# EAGLE design Headlightsv3 (EAGLE 7.6.0)
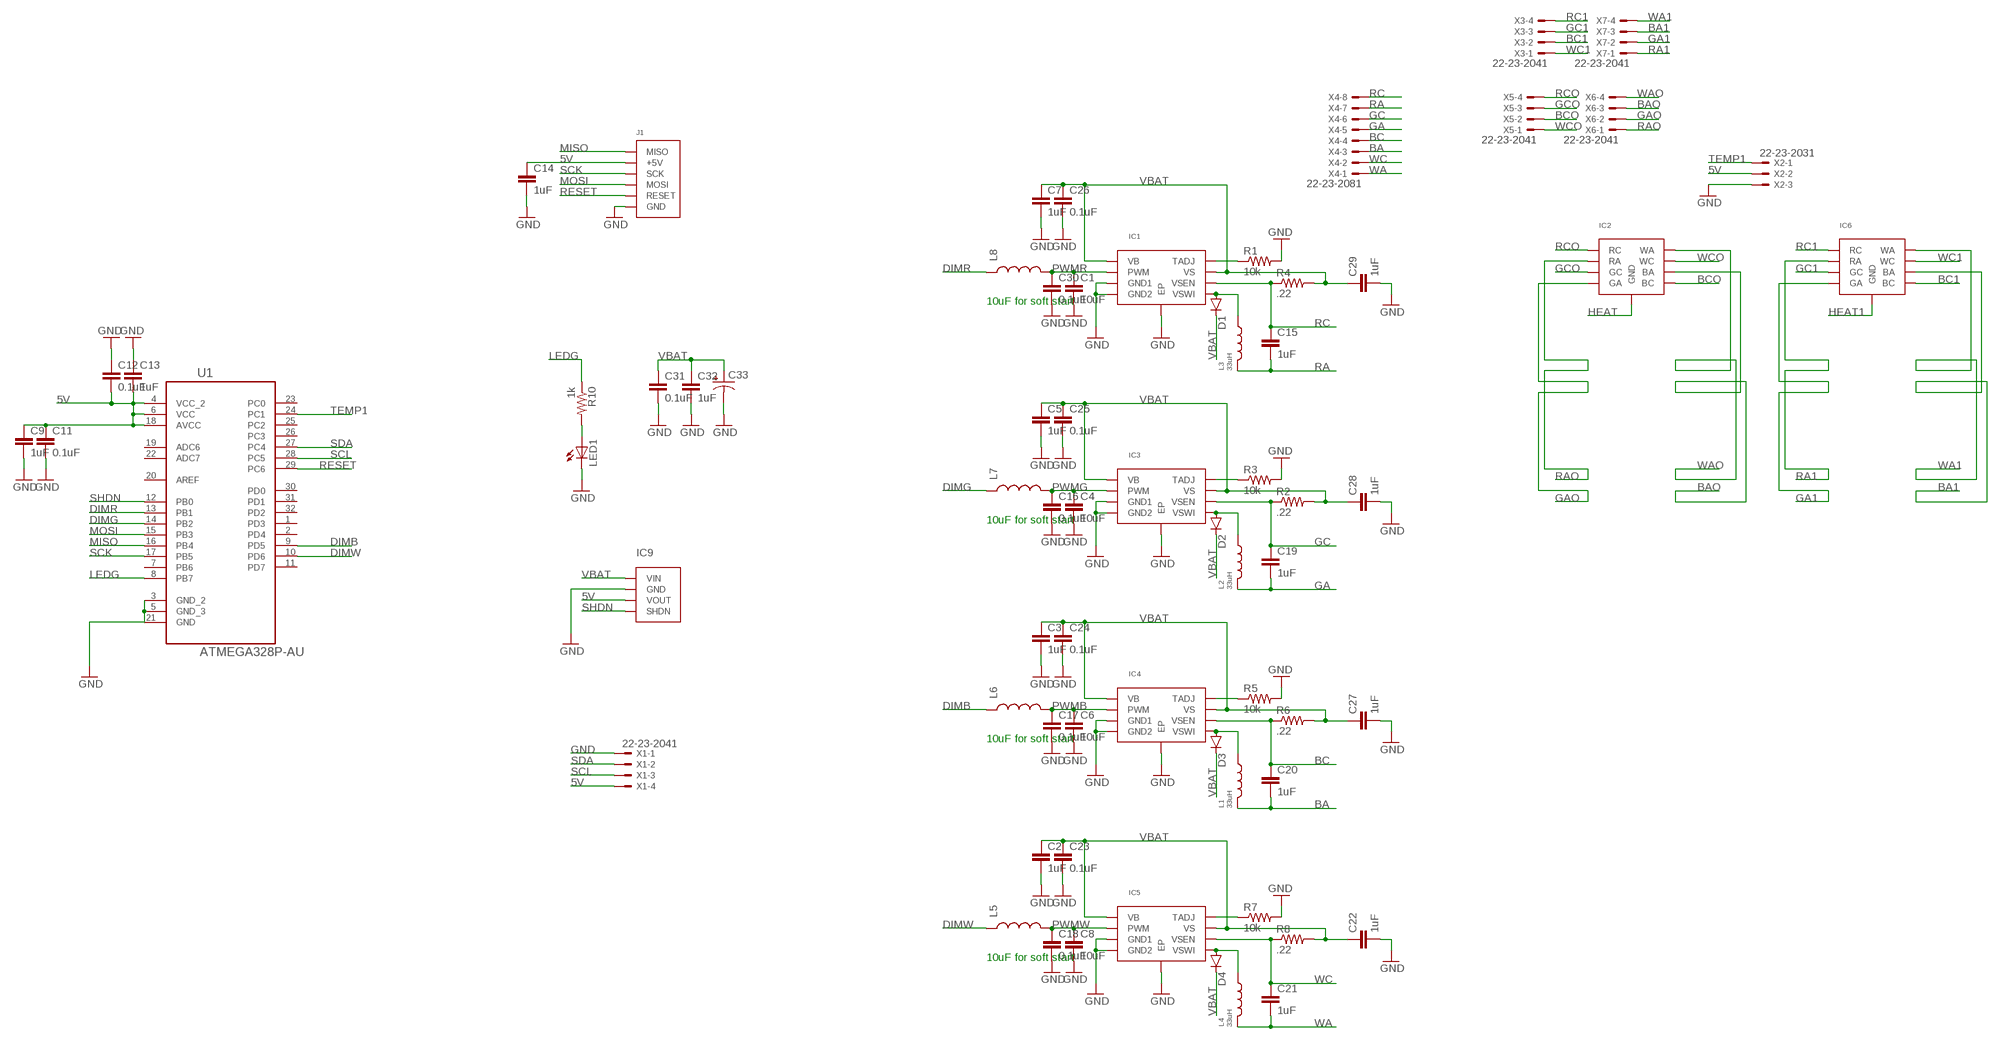
[diagram p0: schematic, sheet 1]

## Parts
C1  10uF  10UF10V10%(0805)  [0805-CAP]
C2  1uF  0.33UF-50V-10%(0805)  [0805-CAP]
C3  1uF  0.33UF-50V-10%(0805)  [0805-CAP]
C4  10uF  10UF10V10%(0805)  [0805-CAP]
C5  1uF  0.33UF-50V-10%(0805)  [0805-CAP]
C6  10uF  10UF10V10%(0805)  [0805-CAP]
C7  1uF  0.33UF-50V-10%(0805)  [0805-CAP]
C8  10uF  10UF10V10%(0805)  [0805-CAP]
C9  1uF  0.33UF-50V-10%(0805)  [0805-CAP]
C11  0.1uF  0.33UF-50V-10%(0805)  [0805-CAP]
C12  0.1uF  0.33UF-50V-10%(0805)  [0805-CAP]
C13  1uF  0.33UF-50V-10%(0805)  [0805-CAP]
C14  1uF  0.33UF-50V-10%(0805)  [0805-CAP]
C15  1uF  0.33UF-50V-10%(0805)  [0805-CAP]
C16  0.1uF  0.33UF-50V-10%(0805)  [0805-CAP]
C17  0.1uF  0.33UF-50V-10%(0805)  [0805-CAP]
C18  0.1uF  0.33UF-50V-10%(0805)  [0805-CAP]
C19  1uF  0.33UF-50V-10%(0805)  [0805-CAP]
C20  1uF  0.33UF-50V-10%(0805)  [0805-CAP]
C21  1uF  0.33UF-50V-10%(0805)  [0805-CAP]
C22  1uF  0.33UF-50V-10%(0805)  [0805-CAP]
C23  0.1uF  0.33UF-50V-10%(0805)  [0805-CAP]
C24  0.1uF  0.33UF-50V-10%(0805)  [0805-CAP]
C25  0.1uF  0.33UF-50V-10%(0805)  [0805-CAP]
C26  0.1uF  0.33UF-50V-10%(0805)  [0805-CAP]
C27  1uF  0.33UF-50V-10%(0805)  [0805-CAP]
C28  1uF  0.33UF-50V-10%(0805)  [0805-CAP]
C29  1uF  0.33UF-50V-10%(0805)  [0805-CAP]
C30  0.1uF  0.33UF-50V-10%(0805)  [0805-CAP]
C31  0.1uF  0.33UF-50V-10%(0805)  [0805-CAP]
C32  1uF  0.33UF-50V-10%(0805)  [0805-CAP]
C33  CAP_POLF80  [NIPPON_F80]
D1  DIODESMA-ALT  [SMA-DIODE_ALT]
D2  DIODESMA-ALT  [SMA-DIODE_ALT]
D3  DIODESMA-ALT  [SMA-DIODE_ALT]
D4  DIODESMA-ALT  [SMA-DIODE_ALT]
IC1  ILD6150_LED_DRIVER  [PG-DSO-8-27]
IC2  LED_RGBW_CONF2  [LED_RGBW_CUSTOM]
IC3  ILD6150_LED_DRIVER  [PG-DSO-8-27]
IC4  ILD6150_LED_DRIVER  [PG-DSO-8-27]
IC5  ILD6150_LED_DRIVER  [PG-DSO-8-27]
IC6  LED_RGBW_CONF2  [LED_RGBW_CUSTOM]
IC9  5VBUCK_DANNY_CUSTOM_PCB  [4PIN_.1']
J1  ISPHEADER  [2X3PIN_.1']
L1  33uH  CHIP_IND  [8X8MM_IND]
L2  33uH  CHIP_IND  [8X8MM_IND]
L3  33uH  CHIP_IND  [8X8MM_IND]
L4  33uH  CHIP_IND  [8X8MM_IND]
L5  INDUCTOR0805  [0805]
L6  INDUCTOR0805  [0805]
L7  INDUCTOR0805  [0805]
L8  INDUCTOR0805  [0805]
LED1  LEDCHIPLED_0805  [CHIPLED_0805]
R1  10k  0.3OHM-1/8W-1%(0805)  [0805]
R2  .22  RESISTOR1206  [1206]
R3  10k  0.3OHM-1/8W-1%(0805)  [0805]
R4  .22  RESISTOR1206  [1206]
R5  10k  0.3OHM-1/8W-1%(0805)  [0805]
R6  .22  RESISTOR1206  [1206]
R7  10k  0.3OHM-1/8W-1%(0805)  [0805]
R8  .22  RESISTOR1206  [1206]
R10  1k  0.3OHM-1/8W-1%(0805)  [0805]
U1  ATMEGA328P-AU  [QFP80P900X900X120-32N]
X1  22-23-2041  [22-23-2041]
X2  22-23-2031  [22-23-2031]
X3  22-23-2041  [22-23-2041]
X4  22-23-2081  [22-23-2081]
X5  22-23-2041  [22-23-2041]
X6  22-23-2041  [22-23-2041]
X7  22-23-2041  [22-23-2041]

## Nets
5V: C9.1 C11.1 C12.2 C13.2 C14.1 IC9.P$3(VOUT) J1.P$2(+5V) U1.4(VCC_2) U1.6(VCC) U1.18(AVCC) X1.4 X2.2
BA: C20.2 L1.P$1 X4.3
BA1: IC6.6(BA) X7.3
BAO: IC2.6(BA) X6.3
BC: C20.1 IC4.P$6(VSEN) R6.1 X4.4
BC1: IC6.5(BC) X3.2
BCO: IC2.5(BC) X5.2
DIMB: L6.1 U1.9(PD5)
DIMG: L7.1 U1.14(PB2)
DIMR: L8.1 U1.13(PB1)
DIMW: L5.1 U1.10(PD6)
GA: C19.2 L2.P$1 X4.5
GA1: IC6.4(GA) X7.2
GAO: IC2.4(GA) X6.2
GC: C19.1 IC3.P$6(VSEN) R2.1 X4.6
GC1: IC6.3(GC) X3.3
GCO: IC2.3(GC) X5.3
GND: C1.2 C2.2 C3.2 C4.2 C5.2 C6.2 C7.2 C8.2 C9.2 C11.2 C12.1 C13.1 C14.2 C16.2 C17.2 C18.2 C22.2 C23.2 C24.2 C25.2 C26.2 C27.2 C28.2 C29.2 C30.2 C31.2 C32.2 C33.- IC1.P$3(GND1) IC1.P$4(GND2) IC1.P$9(EP) IC3.P$3(GND1) IC3.P$4(GND2) IC3.P$9(EP) IC4.P$3(GND1) IC4.P$4(GND2) IC4.P$9(EP) IC5.P$3(GND1) IC5.P$4(GND2) IC5.P$9(EP) IC9.P$2(GND) J1.P$6(GND) LED1.C R1.2 R3.2 R5.2 R7.2 U1.3(GND_2) U1.5(GND_3) X1.1 X2.3
HEAT: IC2.9(GND)
HEAT1: IC6.9(GND)
LEDG: R10.1 U1.8(PB7)
MISO: J1.P$1(MISO) U1.16(PB4)
MOSI: J1.P$4(MOSI) U1.15(PB3)
N$1: IC1.P$8(TADJ) R1.1
N$2: IC3.P$8(TADJ) R3.1
N$3: D2.A IC3.P$5(VSWI) L2.P$2
N$4: IC4.P$8(TADJ) R5.1
N$5: D1.A IC1.P$5(VSWI) L3.P$2
N$6: D3.A IC4.P$5(VSWI) L1.P$2
N$7: IC5.P$8(TADJ) R7.1
N$8: D4.A IC5.P$5(VSWI) L4.P$2
N$19: LED1.A R10.2
PWMB: C6.1 C17.1 IC4.P$2(PWM) L6.2
PWMG: C4.1 C16.1 IC3.P$2(PWM) L7.2
PWMR: C1.1 C30.1 IC1.P$2(PWM) L8.2
PWMW: C8.1 C18.1 IC5.P$2(PWM) L5.2
RA: C15.2 L3.P$1 X4.7
RA1: IC6.2(RA) X7.1
RAO: IC2.2(RA) X6.1
RC: C15.1 IC1.P$6(VSEN) R4.1 X4.8
RC1: IC6.1(RC) X3.4
RCO: IC2.1(RC) X5.4
RESET: J1.P$5(RESET)
SCK: J1.P$3(SCK) U1.17(PB5)
SCL: U1.28(PC5) X1.3
SDA: U1.27(PC4) X1.2
SHDN: IC9.P$4(SHDN) U1.12(PB0)
TEMP1: U1.24(PC1) X2.1
VBAT: C2.1 C3.1 C5.1 C7.1 C22.1 C23.1 C24.1 C25.1 C26.1 C27.1 C28.1 C29.1 C31.1 C32.1 C33.+ D1.C D2.C D3.C D4.C IC1.P$1(VB) IC1.P$7(VS) IC3.P$1(VB) IC3.P$7(VS) IC4.P$1(VB) IC4.P$7(VS) IC5.P$1(VB) IC5.P$7(VS) IC9.P$1(VIN) R2.2 R4.2 R6.2 R8.2
WA: C21.2 L4.P$1 X4.1
WA1: IC6.8(WA) X7.4
WAO: IC2.8(WA) X6.4
WC: C21.1 IC5.P$6(VSEN) R8.1 X4.2
WC1: IC6.7(WC) X3.1
WCO: IC2.7(WC) X5.1
Unconnected: U1.1(PD3) U1.2(PD4) U1.7(PB6) U1.11(PD7) U1.19(ADC6) U1.20(AREF) U1.21(GND) U1.22(ADC7) U1.23(PC0) U1.25(PC2) U1.26(PC3) U1.29(PC6) U1.30(PD0) U1.31(PD1) U1.32(PD2)

## Notes on the sheet
- 10uF for soft start
- 10uF for soft start
- 10uF for soft start
- 10uF for soft start

## Library data of the parts
C1 C4 C6 C8 = SparkFun-Capacitors:10UF10V10%(0805): CAP-11330; PROD_ID: CAP-11330
C2 C3 C5 C7 C9 C11-C32 = SparkFun-Capacitors:0.33UF-50V-10%(0805): CAP-08469; PROD_ID: CAP-08469; VALUE: 0.33uF
C33 = SparkFun-Capacitors:CAP_POL: Capacitor Polarized These are standard SMD and PTH capacitors. Normally 10uF, 47uF, and 100uF in electrolytic and tantalum varieties. Always verify the external diameter of the through hole cap, it varies with capacity, voltage, and manufacturer. The EIA devices should be standard.
D1-D4 = SparkFun-DiscreteSemi:DIODE: Diode These are standard reverse protection diodes and small signal diodes. SMA package can handle up to about 1A. SOD-323 can handle about 200mA. What the SOD-323 package when ordering, there are some mfgs out there that are 5-pin packages.
IC1 IC3-IC5 = lolomolo:ILD6150_LED_DRIVER
IC2 IC6 = lolomolo:LED_RGBW_CONF2
IC9 = lolomolo:5VBUCK_DANNY_CUSTOM_PCB
J1 = lolomolo:ISPHEADER
L1-L4 = lolomolo:CHIP_IND: Chip Inductor
L5-L8 = SparkFun-Passives:INDUCTOR: Inductors Basic Inductor/Choke - 0603 and 1206. Footprints are not proven and vary greatly between part numbers. INDUCTOR POWER 3.3UH 4.0A SMD 0.197" L x 0.197" W x 0.177" H (5.00mm x 5.00mm x 4.50mm)
LED1 = adafruit:LED: LED OSRAM: - CHIPLED LG R971, LG N971, LY N971, LG Q971, LY Q971, LO R971, LY R971 LH N974, LH R974 LS Q976, LO Q976, LY Q976 LO Q996 - Hyper CHIPLED LW Q18S LB Q993, LB Q99A, LB R99A - SideLED LS A670, LO A670, LY A670, LG A670, LP A670 LB A673, LV A673, LT A673, LW A673 LH A674 LY A675 LS A676, LA A676, LO A676, LY A676, LW A676 LS A679, LY A679, LG A679 - Hyper Micro SIDELED® LS Y876, LA Y876, LO Y876, LY Y876 LT Y87S - SmartLED LW L88C, LW L88S LB L89C, LB L89S, LG L890 LS L89K, LO L89K, LY L89K LS L896, LA L896, LO L896, LY L896 - TOPLED LS T670, LO T670, LY T670, LG T670, LP T670 LSG T670, LSP T670, LSY T670, LOP T670, LYG T670 LG T671, LOG T671, LSG T671 LB T673, LV T673, LT T673, LW T673 LH T674 LS T676, LA T676, LO T676, LY T676, LB T676, LH T676, LSB T676, LW T676 LB T67C, LV T67C, LT T67C, LS T67K, LO T67K, LY T67K, LW E67C LS E67B, LA E67B, LO E67B, LY E67B, LB E67C, LV E67C, LT E67C LW T67C LS T679, LY T679, LG T679 LS T770, LO T770, LY T770, LG T770, LP T770 LB T773, LV T773, LT T773, LW T773 LH T774 LS E675, LA E675, LY E675, LS T675 LS T776, LA T776, LO T776, LY T776, LB T776 LHGB T686 LT T68C, LB T68C - Hyper Mini TOPLED® LB M676 - Mini TOPLED Santana® LG M470 LS M47K, LO M47K, LY M47K Source: http://www.osram.convergy.de/
R1 R3 R5 R7 R10 = SparkFun-Resistors:0.3OHM-1/8W-1%(0805): RES-11622; PROD_ID: RES-11622; VALUE: 0.3
R2 R4 R6 R8 = SparkFun-Passives:RESISTOR: Resistor Basic schematic elements and footprints for 0603, 1206, and PTH resistors.
U1 = Atmel_By_element14_Batch_1-00:ATMEGA328P-AU: 8-bit Microcontroller with In-System Programmable Flash; MPN: ATMEGA328P-AU; OC_FARNELL: 1715486; OC_NEWARK: 14R4631; PACKAGE: TQFP-32; SUPPLIER: Atmel
X1 X3 X5-X7 = con-molex:22-23-2041: .100" (2.54mm) Center Header - 4 Pin; MF: MOLEX; MPN: 22-23-2041; OC_FARNELL: 1462920; OC_NEWARK: 38C0355
X2 = con-molex:22-23-2031: .100" (2.54mm) Center Header - 3 Pin; MF: MOLEX; MPN: 22-23-2031; OC_FARNELL: 1462950; OC_NEWARK: 30C0862
X4 = con-molex:22-23-2081: .100" (2.54mm) Center Header - 8 Pin; MF: MOLEX; MPN: 22-23-2081; OC_FARNELL: 1756826; OC_NEWARK: 01C7592

## Board
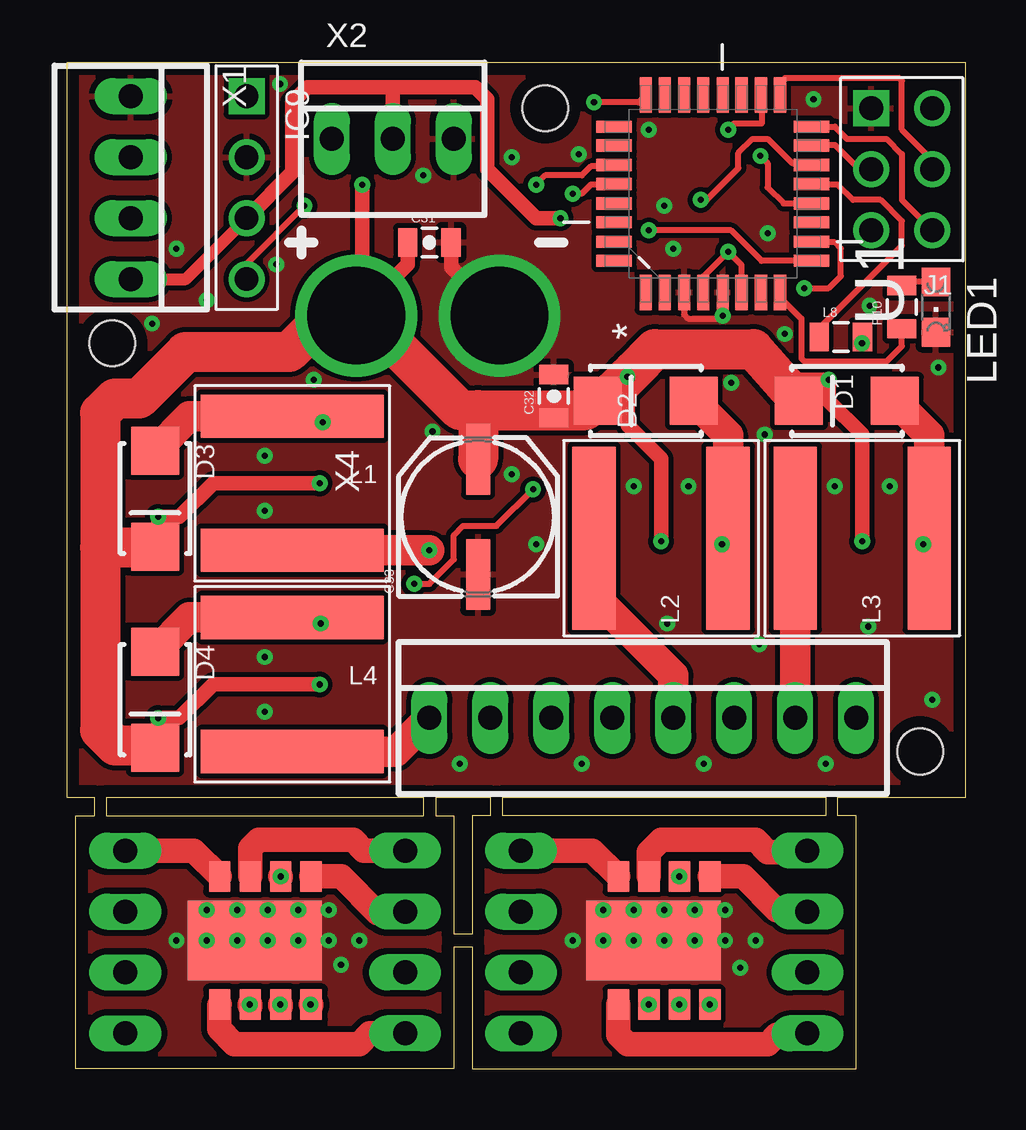
[diagram p1: board, top side]
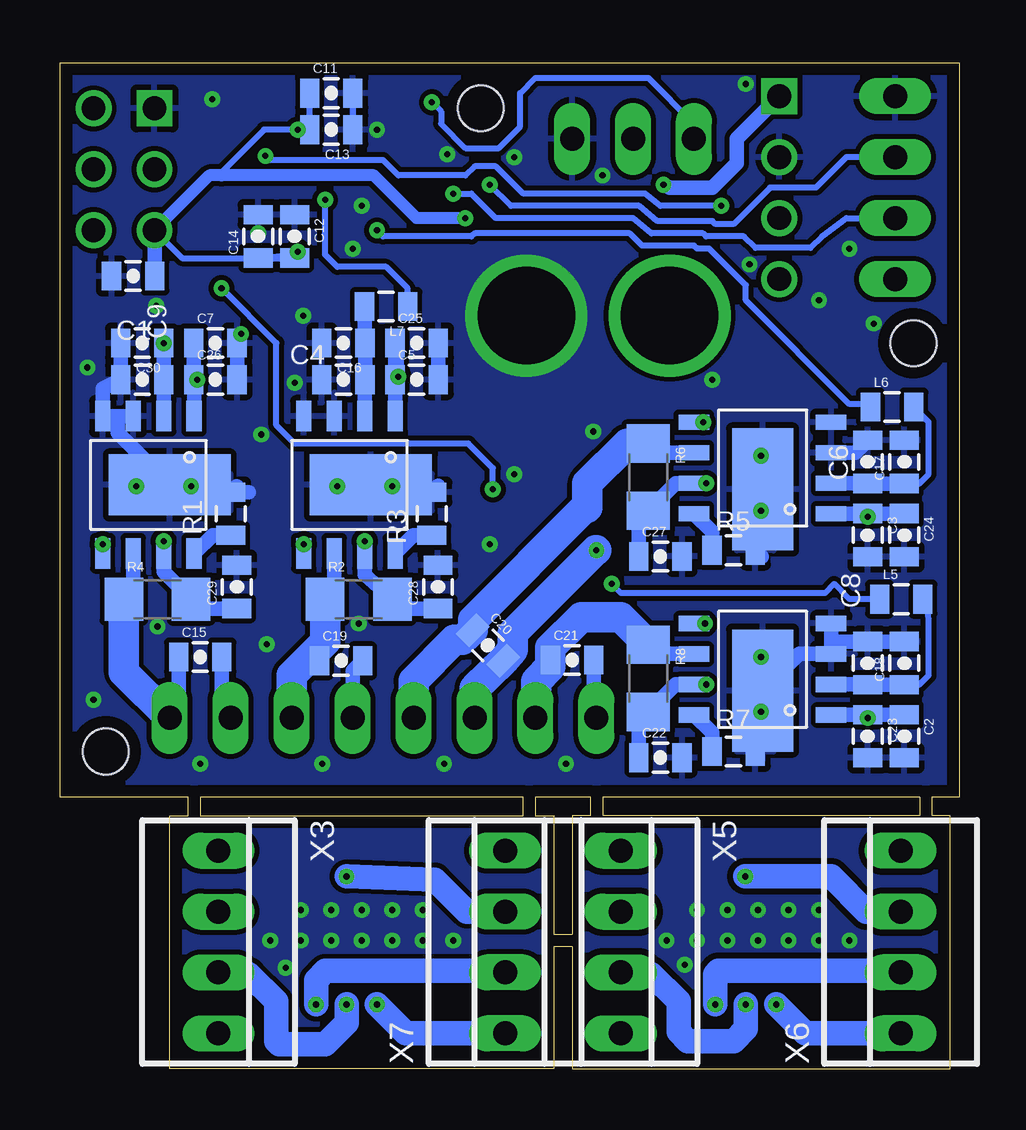
[diagram p2: board, bottom side, seen from below]

Size 37.47 x 41.91 mm. Coordinates in mm from the lower left corner, seen from the top.
Outline: 0,11.3 1.14,11.3 1.14,10.54 0.38,10.54 0.38,0 16.13,0 16.13,5.08 16.89,5.08 16.89,0 32.89,0 32.89,10.54 32.13,10.54 32.13,11.3 37.47,11.3 37.47,41.91 0,41.91 0,11.3
Outline: 1.65,11.3 14.86,11.3 14.86,10.54 1.65,10.54 1.65,11.3
Outline: 15.37,11.3 17.65,11.3 17.65,10.54 16.89,10.54 16.89,5.59 16.13,5.59 16.13,10.54 15.37,10.54 15.37,11.3
Outline: 18.16,11.3 31.62,11.3 31.62,10.54 18.16,10.54 18.16,11.3
Copper layers (1*16): Top 0.035mm / dielectric 1.5mm / Bottom 0.035mm
Design rules "PCBWAY": minimum track width 10mil, minimum drill 10mil, track to track 8mil, track to pad 8mil, pad to pad 8mil, via to via 8mil, smd to smd 8mil, copper to edge 20mil, drill to drill 8mil, minimum pad ring 10mil, minimum via ring 8mil, stop-mask expansion 4mil, vias tented up to drill 0mil, thermal gap 10mil
Holes 1.91 mm at 35.56,13.21 1.91,30.23 19.94,40.01

### Footprints (pad centres in the part's own frame; a part is rotated, then mirrored left to right if it is on the bottom)
0805-CAP = smd 0.8 x 1.2: 1 -0.9,0; 2 0.9,0
NIPPON_F80 = smd 2.95 x 1: + 2.4,0; - -2.4,0
SMA-DIODE_ALT = smd 2 x 2: A -2,0; C 2,0
PG-DSO-8-27 = smd 0.635 x 1.27: P$1 0,0; P$2 1.27,0; P$3 2.54,0; P$4 3.81,0; P$5 3.81,5.715; P$6 2.54,5.715; P$7 1.27,5.715; P$8 0,5.715 | smd 5.08 x 2.54: P$9 1.016,2.857
LED_RGBW_CUSTOM = smd 0.889 x 1.27: 1 0,-0.254; 2 1.27,-0.254; 3 2.54,-0.254; 4 3.81,-0.254; 5 3.81,5.08; 6 2.54,5.08; 7 1.27,5.08; 8 0,5.08 | smd 5.588 x 3.302: 9 1.46,2.413
4PIN_.1' = drill 0.991 square: P$1 -3.81,0 | drill 0.991: P$2 -1.27,0; P$3 1.27,0; P$4 3.81,0
2X3PIN_.1' = drill 0.991: P$1 -1.27,1.27; P$2 1.27,1.27; P$3 -1.27,-1.27; P$4 1.27,-1.27; P$5 -1.27,-3.81 | drill 0.991 square: P$6 1.27,-3.81
8X8MM_IND = smd 1.803 x 7.62: P$1 -2.794,0; P$2 2.794,0
0805 = smd 0.8 x 1.2: 1 -0.9,0; 2 0.9,0
CHIPLED_0805 = smd 1.2 x 1.2: A 0,-1.05; C 0,1.05
1206 = smd 1.6 x 1.8: 1 -1.4,0; 2 1.4,0
QFP80P900X900X120-32N = smd 1.473 x 0.508: 1 -4.115,2.794; 2 -4.115,2.007; 3 -4.115,1.194; 4 -4.115,0.406; 5 -4.115,-0.406; 6 -4.115,-1.194; 7 -4.115,-2.007; 8 -4.115,-2.794; 17 4.115,-2.794; 18 4.115,-2.007; 19 4.115,-1.194; 20 4.115,-0.406; 21 4.115,0.406; 22 4.115,1.194; 23 4.115,2.007; 24 4.115,2.794 | smd 0.508 x 1.473: 9 -2.794,-4.115; 10 -2.007,-4.115; 11 -1.194,-4.115; 12 -0.406,-4.115; 13 0.406,-4.115; 14 1.194,-4.115; 15 2.007,-4.115; 16 2.794,-4.115; 25 2.794,4.115; 26 2.007,4.115; 27 1.194,4.115; 28 0.406,4.115; 29 -0.406,4.115; 30 -1.194,4.115; 31 -2.007,4.115; 32 -2.794,4.115
22-23-2041 = drill 1 long: 1 -3.81,0; 2 -1.27,0; 3 1.27,0; 4 3.81,0
22-23-2031 = drill 1 long: 1 -2.54,0; 2 0,0; 3 2.54,0
22-23-2081 = drill 1 long: 1 -8.89,0; 2 -6.35,0; 3 -3.81,0; 4 -1.27,0; 5 1.27,0; 6 3.81,0; 7 6.35,0; 8 8.89,0

### Placement (x,y rotation side)
C1  34.04,28.7 180 bottom
C2  2.29,13.84 270 bottom
C3  3.81,22.23 270 bottom
C4  25.65,28.7 180 bottom
C5  22.61,28.7 0 bottom
C6  3.81,25.27 90 bottom
C7  30.99,30.23 0 bottom
C8  3.81,16.89 90 bottom
C9  34.42,33.02 180 bottom
C11  26.16,40.64 0 bottom
C12  27.69,34.67 270 bottom
C13  26.16,39.12 180 bottom
C14  29.21,34.67 90 bottom
C15  31.62,17.14 0 bottom
C16  25.65,30.23 180 bottom
C17  2.29,25.27 90 bottom
C18  2.29,16.89 90 bottom
C19  25.76,16.99 0 bottom
C20  19.63,17.63 315 bottom
C21  16.13,17.02 0 bottom
C22  12.45,12.95 0 bottom
C23  3.81,13.84 270 bottom
C24  2.29,22.23 270 bottom
C25  22.61,30.23 0 bottom
C26  30.99,28.7 0 bottom
C27  12.45,21.34 0 bottom
C28  21.72,20.07 90 bottom
C29  30.1,20.07 90 bottom
C30  34.04,30.23 180 bottom
C31  15.11,34.42 0 top
C32  20.29,28.02 90 top
C33  17.14,22.99 90 top
D1  32.51,27.81 180 top
D2  24.13,27.81 180 top
D3  3.68,23.75 270 top
D4  3.68,15.37 270 top
IC1  31.88,27.18 180 bottom
IC2  6.38,2.92 0 top
IC3  23.5,27.18 180 bottom
IC4  5.33,23.11 90 bottom
IC5  5.33,14.73 90 bottom
IC6  22.99,2.92 0 top
IC9  7.49,36.7 270 top
J1  34.8,36.2 180 top
L1  9.4,24.38 90 top
L2  24.77,22.1 0 top
L3  33.15,22.1 0 top
L4  9.4,16 90 top
L5  2.41,19.56 0 bottom
L6  2.79,27.56 0 bottom
L7  23.88,31.75 180 bottom
L8  32.26,30.48 0 top
LED1  36.22,31.72 180 top
R1  30.35,23.11 90 bottom
R2  25.02,19.56 0 bottom
R3  21.97,23.11 90 bottom
R4  33.4,19.56 0 bottom
R5  9.4,21.59 0 bottom
R6  12.95,24.64 270 bottom
R7  9.4,13.21 0 bottom
R8  12.95,16.26 270 bottom
R10  34.8,31.72 90 top
U1  26.92,36.45 90 top
X1  2.67,36.7 270 top
X2  13.59,38.73 0 top
X3  30.86,5.27 270 bottom
X4  24,14.61 0 top
X5  14.1,5.27 270 bottom
X6  2.44,5.27 90 bottom
X7  18.92,5.27 90 bottom

### Tracks (layer width: path | path; a pad name or v marks a point on that pad's centre or on a via)
5V  (via drill 0.25)
  Top 0.254: U1.4 26.52,32.99 v27.56,34.04 28.12,33.48 U1.6 | U1.18 28.96,40.54 28.96,39.37 27.81,39.37 v27.56,39.12
  Top 0.508: X1.4 4.95,32.89 IC9.P$3
  Top 0.61: v20.57,35.43 19.56,35.43 17.53,37.47 17.53,40.39 17.02,40.89 13.59,40.89 | IC9.P$3 9.4,37.34 9.4,40.26 10.03,40.89 13.59,40.89 | X2.2 13.59,40.89
  Bottom 0.254: C11.1 C13.2 v27.56,39.12 28.96,39.12 30.73,37.34 30.73,37.21 | C14.1 C12.2 | v27.56,34.04 27.44,33.91 C14.1 | J1.P$2 32.37,33.77 C14.1
  Bottom 0.508: v20.57,35.43 22.61,35.43 24.38,37.21 30.73,37.21 31.24,37.21 J1.P$2
  Bottom 0.61: C9.1 33.52,34.91 J1.P$2
BA  (via drill 0.25)
  Top 1.27: v15.11,21.59 L1.P$1
  Bottom 1.27: v15.11,21.59 15.14,21.59 18.59,18.14 18.59,17.45 C20.2 20.19,15.85 X4.3
BA1  (via drill 0.25)
  Bottom 1.016: X7.3 20.51,6.54 21.84,7.87 IC6.6
  other vias: 25.53,8
BAO  (via drill 0.25)
  Top 1.016: IC2.6 8.91,7.98 8.89,8
  Bottom 1.016: X6.3 3.87,6.54 5.33,8 IC2.6
  other vias: 8.92,8
BC
  Bottom 0.61: R6.1 12.57,25.65 IC4.P$6
  Bottom 1.27: R6.1 13.84,26.04 15.49,24.38 15.49,23.37 15.6,23.37 20.25,18.69 C20.1 20.7,17.86 21.03,17.86 22.73,16.15 X4.4
BC1
  Top 1.016: IC6.5 28.19,8 29.59,6.6 30.8,6.6 X3.2
BCO
  Top 1.016: IC2.5 11.43,8 12.95,6.48 14.03,6.48 X5.2
DIMB  (via drill 0.25)
  Top 0.254: U1.9 28.96,33.66 27.69,34.92 v24.26,34.92
  Bottom 0.254: L6.1 3.82,27.69 4.57,27.69 8.89,32 8.89,32.64 10.41,34.16 10.92,34.16 11.05,34.29 13.21,34.29 13.72,34.8 20.19,34.8 20.32,34.67 24,34.67 v24.26,34.92
DIMG  (via drill 0.25)
  Top 0.254: U1.14 30.96,37.72 30.23,37.72 29.21,38.73 28.57,38.73 27.99,38.15 27.99,37.52 26.67,36.2 v26.42,36.2
  Bottom 0.254: L7.1 22.98,32.5 23.88,33.4 25.91,33.4 26.42,33.91 v26.42,36.2
DIMR
  Top 0.254: L8.1 31.36,30.85 34.8,34.29 34.8,35.31 33.91,36.2 32.77,36.2 32.13,36.83 31.06,36.83 U1.13
DIMW  (via drill 0.25)
  Top 0.254: v14.48,20.19 15.11,20.19 16.13,21.21 16.13,22.23 16.51,22.61 17.91,22.61 v19.43,24.13 | v30.73,32.51 31.75,32.51 32.26,33.02 32.26,34.16 32,34.42 31.06,34.42 U1.10
  Bottom 0.254: L5.1 4.57,19.56 5.21,20.19 5.59,19.81 14.1,19.81 v14.48,20.19 | v30.73,32.51 28.45,30.23 28.45,26.8 27.69,26.04 20.45,26.04 19.43,25.02 v19.43,24.13
GA
  Top 1.27: X4.5 25.27,16.38 21.97,19.68 L2.P$1
  Bottom 0.61: C19.2 25.27,16.57 X4.5
GA1  (via drill 0.25)
  Bottom 1.016: IC6.4 26.8,3.68 26.42,4.06 18.86,4.06 X7.2
  other vias: 26.8,2.67
GAO  (via drill 0.25)
  Top 1.016: IC2.4 10.19,2.64 v10.16,2.67
  Bottom 1.016: v10.16,2.67 10.16,3.94 10.03,4.06 2.5,4.06 X6.2
GC
  Bottom 0.61: R2.1 26.04,20.2 IC3.P$6 | C19.1 27.3,16.9 27.3,16.89
  Bottom 1.27: X4.6 27.81,16.38 27.3,16.89 26.42,17.78 R2.1
GC1  (via drill 0.25)
  Bottom 1.016: IC6.3 25.53,1.91 26.42,1.02 28.32,1.02 28.45,1.14 28.45,2.79 29.59,3.94 30.8,3.94 X3.3
  other vias: 25.53,2.67
GCO  (via drill 0.25)
  Top 1.016: IC2.3 8.91,2.56 v8.89,2.67
  Bottom 1.016: v8.89,2.67 8.89,1.65 9.4,1.14 11.3,1.14 11.68,1.52 11.68,2.79 12.83,3.94 14.03,3.94 X5.3
GND  (via drill 0.25, 4.06)
  Top 0.254: U1.3 25.73,31.42 25.91,31.24 27.18,31.24 27.3,31.37 27.3,32.31 U1.5
  Top 0.61: C31.2 16.01,33.39 v18.03,31.37
  Bottom 0.254: C11.2 C13.1
  Bottom 0.61: IC1.P$3 35.05,27.18 | 35.05,27.18 IC1.P$4 35.69,28.33 C1.2 C30.2 | C26.2 C7.2 30.09,28.46 30.1,28.45 | R1.2 31.55,23.94 IC1.P$9 35.05,26.48 35.05,27.18 | 29.59,24 30.21,24 R1.2 | R5.2 | 8.5,15.44 IC5.P$9 6.67,17.27 IC5.P$3 5.33,17.78 | R5.2 8.5,23.82 IC4.P$9 | IC3.P$9 24.19,24 R3.2 21.71,24.28 | 5.33,17.78 IC5.P$4 | C18.2 C8.2 5.32,17.79 5.33,17.78 | 8.23,21.32 R5.2 | C5.2 C25.2 | 30.1,24.27 R1.2 | IC4.P$3 4.33,25.65 C6.2
  other vias: 3.56,31.04 10.29,28.7 15.24,26.54 19.56,21.84 18.54,24.77 16.38,12.7 21.46,12.7 26.54,12.7 31.62,12.7 36.07,15.37 29.08,26.42 36.32,29.21 33.45,31.78 25.27,34.16 24.89,35.94 24.26,39.12 18.54,37.97 31.11,40.39 8.89,41.02 4.57,34.16 5.84,32 23.62,24.26 25.91,24.26 8.26,14.86 34.29,24.26 32,24.26 8.26,17.14 8.26,23.24 8.26,25.53 8.74,33.5 14.86,37.21 25.02,18.54 33.4,18.41 29.21,34.8 29.92,30.61 27.33,31.37 28.85,17.68 27.69,28.57 21.34,38.1
  pour Bottom: -0.89,41.91 37.34,41.91 37.34,11.3 -0.89,11.3
  pour Top: -0.89,11.3 37.34,11.3 37.34,41.91 -0.89,41.91
HEAT  (via drill 0.25)
  other vias: 4.57,5.33 5.84,5.33 5.84,6.6 7.11,5.33 8.38,5.33 9.65,5.33 10.92,5.33 12.19,5.33 11.43,4.32 10.92,6.6 9.65,6.6 8.38,6.6 7.11,6.6
  pour Top (isolate 0.254, no thermals): 0.38,10.54 16.13,10.54 16.13,0 0.38,0
  pour Bottom (isolate 0.254, no thermals): 0.38,10.54 16.13,10.54 16.13,0 0.38,0
HEAT1  (via drill 0.25)
  other vias: 21.08,5.33 22.35,6.6 22.35,5.33 23.62,5.33 24.89,5.33 26.16,5.33 27.43,5.33 28.7,5.33 28.07,4.19 27.43,6.6 26.16,6.6 24.89,6.6 23.62,6.6
  pour Bottom (no thermals): 16.89,10.54 16.89,0 32.89,0 32.89,10.54
  pour Top (no thermals): 16.89,10.54 16.89,0 32.89,0 32.89,10.54
LEDG
  Top 0.254: U1.8 29.72,32.13 30.61,31.24 30.61,29.59 30.73,29.46 34.16,29.46 34.8,30.1 R10.1
MISO
  Top 0.254: J1.P$1 34.8,36.2 34.8,38.1 34.16,38.73 32.51,38.73 32,39.24 U1.16
MOSI
  Top 0.254: U1.15 30.56,38.48 32,38.48 33.02,37.47 J1.P$4
N$1
  Bottom 0.61: IC1.P$8 31.1,22.21 R1.1
N$2
  Bottom 0.61: IC3.P$8 22.74,22.21 R3.1
N$3  (via drill 0.25)
  Top 0.61: v27.3,21.84 27.3,22.86 L2.P$2
  Top 1.27: D2.A 27.56,26.38 L2.P$2
  Bottom 0.61: IC3.P$5 v27.3,21.84
N$4
  Bottom 0.61: R5.1 10.3,22.36 IC4.P$8
N$5  (via drill 0.25)
  Top 0.61: v35.69,21.84 35.69,22.86 L3.P$2
  Top 1.27: D1.A 35.94,26.38 L3.P$2
  Bottom 0.61: IC1.P$5 v35.69,21.84
N$6  (via drill 0.25)
  Top 0.61: v10.67,26.92 9.14,26.92 8.89,27.18
  Top 1.27: D3.A 5.11,27.18 8.89,27.18 L1.P$2
  Bottom 0.61: IC4.P$5 v10.67,26.92
N$7
  Bottom 0.61: R7.1 10.3,13.98 IC5.P$8
N$8  (via drill 0.25)
  Top 0.254: L4.P$2 10.16,18.8 v10.59,18.54
  Top 1.27: D4.A 5.11,18.8 L4.P$2
  Bottom 0.61: v10.59,18.54 IC5.P$5
N$19
  Top 0.254: LED1.A 34.65,32.77 R10.2
PWMB
  Bottom 0.254: C17.1 1.66,24.37 1.27,24.77 1.27,26.93 L6.2
  Bottom 0.61: IC4.P$2 3.82,24.38 C6.1 C17.1
PWMG
  Bottom 0.61: IC3.P$2 24.77,28.69 C4.1 C16.1 24.78,30.25 L7.2
PWMR  (via drill 0.25)
  Top 0.254: L8.2 33.16,30.25 C30.1
  Bottom 0.61: IC1.P$2 33.15,28.33 C1.1 C30.1
  other vias: 33.14,30.23
PWMW
  Bottom 0.254: C18.1 1.66,15.99 1.27,16.38 1.27,18.54 1.28,19.05 L5.2
  Bottom 0.61: IC5.P$2 3.82,16 C8.1 C18.1
RA
  Top 1.27: X4.7 L3.P$1
  Bottom 0.61: C15.2 30.72,14.97 X4.7
RA1  (via drill 0.25)
  Bottom 1.016: IC6.2 23.05,1.46 X7.1
  other vias: 24.26,2.67
RAO  (via drill 0.25)
  Top 1.016: IC2.2 7.64,2.56 v7.62,2.67
  Bottom 1.016: v7.62,2.67 6.41,1.46 X6.1
RC
  Bottom 0.61: IC1.P$6 34.42,20.07 R4.1 34.67,19.56 34.67,18.54 | C15.1 32.52,14.97 X4.8
  Bottom 1.27: X4.8 34.8,16.51 R4.1
RC1
  Top 1.016: IC6.1 22.99,1.4 23.37,1.02 29.21,1.02 29.59,1.4 30.8,1.4 X3.4
RCO
  Top 1.016: X5.4 12.64,1.46 12.19,1.02 6.99,1.02 6.35,1.65 6.35,2.64 IC2.1
SCK
  Top 0.254: J1.P$3 36.07,37.85 34.8,39.12 34.8,41.15 34.67,41.27 29.92,41.27 U1.17
SCL  (via drill 0.25)
  Top 0.254: U1.28 22.78,36.83 21.84,36.83 21.46,36.45 v21.08,36.45
  Bottom 0.254: v21.08,36.45 20.32,36.45 19.3,35.43 13.59,35.43 12.83,34.8 10.67,34.8 10.54,34.67 8.97,34.67 8.48,34.19 6.2,34.19 5.71,34.67 4.7,35.43 X1.3
SDA  (via drill 0.25)
  Top 0.254: 22.61,37.59 U1.27 22.76,37.59 21.84,37.59 21.46,37.21 19.94,37.21 v19.56,36.83
  Bottom 0.254: X1.2 4.7,37.97 5.97,36.7 7.87,36.7 9.4,35.18 10.16,35.18 10.29,35.31 12.57,35.31 13.34,35.94 18.67,35.94 v19.56,36.83
SHDN  (via drill 0.25)
  Top 0.254: IC9.P$4 7.49,33.53 v9.91,35.94 | v28.91,38.02 29.21,37.72 29.21,36.7 29.87,36.04 U1.12
  Bottom 0.254: v9.91,35.94 12.45,35.94 13.08,36.45 18.16,36.45 19.3,37.59 20.19,37.59 20.57,37.21 23.37,37.21 24,37.85 28.73,37.85 v28.91,38.02
TEMP1  (via drill 0.25)
  Top 0.254: U1.24 23.82,40.26 v21.97,40.26
  Bottom 0.254: v21.97,40.26 21.59,39.88 21.59,39.37 20.57,38.35 19.18,38.35 18.29,39.24 18.29,40.64 17.65,41.27 12.95,41.27 11.05,39.37 X2.1
VBAT  (via drill 0.25, 4.06)
  Top 0.406: C32.1 20.61,27.43 21.46,27.43
  Top 0.61: 31.11,28.32 31.15,28.35 D1.C 30.64,28.7 v31.75,28.7 31.75,27.81 33.15,26.42 v33.15,21.97 | D4.C 3.81,13.49 v3.81,14.61 4.7,14.61 6.1,16 v10.54,16 | D3.C 3.81,21.88 v3.81,22.99 4.7,22.99 6.1,24.38 v10.54,24.38 | 23.62,29.08 23.62,29.59 v23.37,28.83 23.37,26.8 24.77,25.4 v24.77,21.97 | C31.1 14.21,33.52 v12.06,31.37 12.32,31.62 v12.32,36.83
  Top 1.676: 1.4,21.72 1.4,14.1 2.03,13.46 3.59,13.46 D4.C | 1.4,21.72 1.4,27.3 2.01,27.91 3.02,27.91 4.95,29.84 9.27,29.84 10.79,31.37 v12.06,31.37 12.45,31.37 16.38,27.43 17.14,27.43 | 1.4,21.72 3.65,21.72 D3.C | 17.14,27.43 21.46,27.43 21.62,27.43 D2.C 22.35,27.81 v23.37,28.83 23.62,29.08 24.51,29.97 28.61,29.97 D1.C | 17.14,27.43 C33.+
  Bottom 0.254: 23.51,29.97 23.43,29.9 | IC3.P$1
  Bottom 0.61: IC1.P$1 C7.1 C26.1 v31.75,28.7 | C29.1 31.61,19.17 R4.2 33.15,20.7 IC1.P$7 v33.15,21.97 | C28.1 23.23,19.17 R2.2 24.77,20.58 IC3.P$7 v24.77,21.97 | C27.1 13.35,22.85 R6.2 11.81,24.38 IC4.P$7 v10.54,24.38 | C22.1 13.35,14.46 R8.2 11.81,16 IC5.P$7 v10.54,16 | C2.1 C23.1 | C23.1 5.32,14.74 IC5.P$1 | C24.1 C3.1 | C3.1 5.32,23.12 IC4.P$1 | C23.1 v3.81,14.61 | C3.1 v3.81,22.99 | 23.51,28.95 23.5,28.96 23.51,28.96 | 23.51,28.96 23.51,28.95 | 23.51,28.95 C5.1 IC3.P$1 | 23.51,29.97 23.51,28.96 | C25.1 23.51,29.97 | 23.51,29.97 23.5,29.97 | IC3.P$1 | 23.51,29.97 23.5,29.96 v23.37,28.83 | IC9.P$1 9.27,38.73 9.27,37.72 10.29,36.7 12.06,36.7 v12.32,36.83
WA
  Top 1.27: X4.1 13.72,13.21 L4.P$1
  Bottom 0.61: C21.2 15.23,14.72 X4.1
WA1
  Top 1.016: X7.4 21.91,9.08 IC6.8
WAO
  Top 1.016: X6.4 5.3,9.08 IC2.8
WC
  Bottom 0.61: R8.1 12.57,17.27 IC5.P$6
  Bottom 1.27: X4.2 17.63,16.14 17.03,16.74 C21.1 17.03,17.54 15.75,18.8 14.09,18.8 R8.1
WC1
  Top 1.016: IC6.7 24.26,9.02 24.77,9.53 28.7,9.53 29.21,9.02 30.8,9.02 X3.1
WCO
  Top 1.016: X5.1 12.38,9.08 11.94,9.53 8,9.53 7.64,9.17 IC2.7